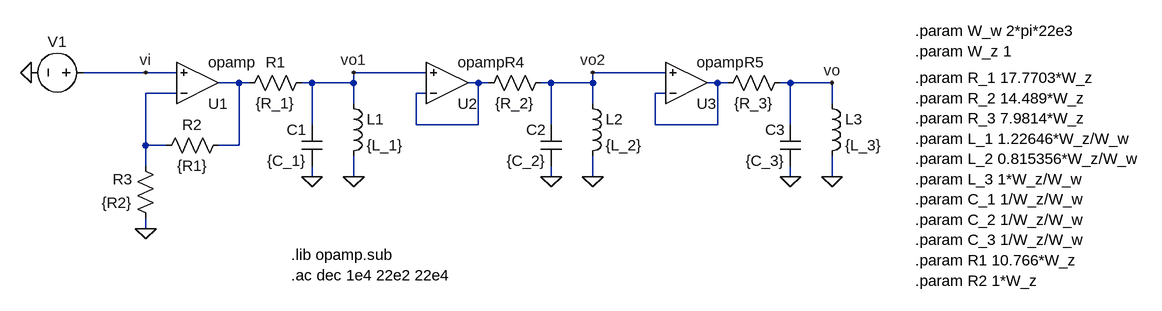
[diagram p0: schematic sim_pasivo.asc]
sim_pasivo.asc, the LTspice schematic file:
Version 4
SHEET 1 1452 680
WIRE -96 240 -192 240
WIRE -48 240 -96 240
WIRE 336 240 224 240
WIRE 704 240 592 240
WIRE 48 256 16 256
WIRE 64 256 48 256
WIRE 160 256 144 256
WIRE 224 256 224 240
WIRE 224 256 160 256
WIRE 416 256 400 256
WIRE 432 256 416 256
WIRE 528 256 512 256
WIRE 592 256 592 240
WIRE 592 256 528 256
WIRE 784 256 768 256
WIRE 800 256 784 256
WIRE 896 256 880 256
WIRE 960 256 896 256
WIRE -48 272 -96 272
WIRE 336 272 320 272
WIRE 704 272 688 272
WIRE 224 288 224 256
WIRE 592 288 592 256
WIRE 960 288 960 256
WIRE 160 320 160 256
WIRE 320 320 320 272
WIRE 416 320 416 256
WIRE 416 320 320 320
WIRE 528 320 528 256
WIRE 688 320 688 272
WIRE 784 320 784 256
WIRE 784 320 688 320
WIRE 896 320 896 256
WIRE -96 352 -96 272
WIRE -64 352 -96 352
WIRE 48 352 48 256
WIRE 48 352 16 352
WIRE -96 384 -96 352
WIRE 160 400 160 384
WIRE 224 400 224 368
WIRE 528 400 528 384
WIRE 592 400 592 368
WIRE 896 400 896 384
WIRE 960 400 960 368
WIRE -96 480 -96 464
FLAG 160 400 0
FLAG 224 400 0
FLAG -96 480 0
FLAG 528 400 0
FLAG 592 400 0
FLAG 896 400 0
FLAG 960 400 0
FLAG -272 240 0
FLAG 960 256 vo
FLAG -96 240 vi
FLAG 224 240 vo1
FLAG 592 240 vo2
SYMBOL res 160 240 R90
WINDOW 0 0 56 VBottom 2
WINDOW 3 32 56 VTop 2
SYMATTR InstName R1
SYMATTR Value {R_1}
SYMBOL cap 176 320 M0
SYMATTR InstName C1
SYMATTR Value {C_1}
SYMBOL ind 208 272 R0
SYMATTR InstName L1
SYMATTR Value {L_1}
SYMBOL opamp -16 320 M180
SYMATTR InstName U1
SYMBOL res 32 336 R90
WINDOW 0 0 56 VBottom 2
WINDOW 3 32 56 VTop 2
SYMATTR InstName R2
SYMATTR Value {R1}
SYMBOL res -80 480 R180
WINDOW 0 36 76 Left 2
WINDOW 3 36 40 Left 2
SYMATTR InstName R3
SYMATTR Value {R2}
SYMBOL res 528 240 R90
WINDOW 0 0 56 VBottom 2
WINDOW 3 32 56 VTop 2
SYMATTR InstName R4
SYMATTR Value {R_2}
SYMBOL cap 544 320 M0
SYMATTR InstName C2
SYMATTR Value {C_2}
SYMBOL ind 576 272 R0
SYMATTR InstName L2
SYMATTR Value {L_2}
SYMBOL opamp 368 320 M180
SYMATTR InstName U2
SYMBOL res 896 240 R90
WINDOW 0 0 56 VBottom 2
WINDOW 3 32 56 VTop 2
SYMATTR InstName R5
SYMATTR Value {R_3}
SYMBOL cap 912 320 M0
SYMATTR InstName C3
SYMATTR Value {C_3}
SYMBOL ind 944 272 R0
SYMATTR InstName L3
SYMATTR Value {L_3}
SYMBOL opamp 736 320 M180
SYMATTR InstName U3
SYMBOL voltage -176 240 R90
WINDOW 0 -32 56 VBottom 2
WINDOW 3 32 56 VTop 2
SYMATTR InstName V1
SYMATTR Value ""
SYMATTR Value2 AC 1
TEXT 1088 248 Left 2 !.param R_1 17.7703*W_z\n.param R_2 14.489*W_z\n.param R_3 7.9814*W_z\n.param L_1 1.22646*W_z/W_w\n.param L_2 0.815356*W_z/W_w\n.param L_3 1*W_z/W_w\n.param C_1 1/W_z/W_w\n.param C_2 1/W_z/W_w\n.param C_3 1/W_z/W_w\n.param R1 10.766*W_z\n.param R2 1*W_z
TEXT 128 520 Left 2 !.lib opamp.sub
TEXT 128 552 Left 2 !.ac dec 1e4 22e2 22e4
TEXT 1088 176 Left 2 !.param W_w 2*pi*22e3\n.param W_z 1

The netlist it stands for:
* sim_pasivo.asc
R1 vo1 N001 {R_1}
C1 vo1 0 {C_1}
L1 vo1 0 {L_1}
XU1 N004 vi N001 opamp Aol=100K GBW=10Meg  ; pins invin noninvin out
R2 N001 N004 {R1}
R3 0 N004 {R2}
R4 vo2 N002 {R_2}
C2 vo2 0 {C_2}
L2 vo2 0 {L_2}
XU2 N002 vo1 N002 opamp Aol=100K GBW=10Meg  ; pins invin noninvin out
R5 vo N003 {R_3}
C3 vo 0 {C_3}
L3 vo 0 {L_3}
XU3 N003 vo2 N003 opamp Aol=100K GBW=10Meg  ; pins invin noninvin out
V1 vi 0 AC 1
.param R_1 17.7703*W_z
.param R_2 14.489*W_z
.param R_3 7.9814*W_z
.param L_1 1.22646*W_z/W_w
.param L_2 0.815356*W_z/W_w
.param L_3 1*W_z/W_w
.param C_1 1/W_z/W_w
.param C_2 1/W_z/W_w
.param C_3 1/W_z/W_w
.param R1 10.766*W_z
.param R2 1*W_z
.lib opamp.sub
.ac dec 1e4 22e2 22e4
.param W_w 2*pi*22e3
.param W_z 1
.backanno
.end